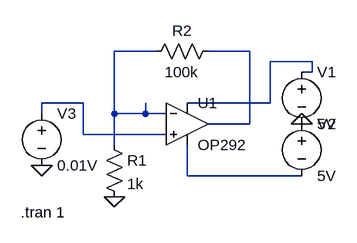
[diagram p0: schematic opamp.asc]
opamp.asc, the LTspice schematic file:
Version 4.1
SHEET 1 880 680
WIRE 144 16 80 16
WIRE 288 16 224 16
WIRE 384 32 320 32
WIRE 384 48 384 32
WIRE 384 48 368 48
WIRE 32 96 -32 96
WIRE 320 96 320 32
WIRE 320 96 192 96
WIRE -32 112 -32 96
WIRE 80 112 80 16
WIRE 128 112 128 96
WIRE 128 112 80 112
WIRE 160 112 128 112
WIRE 288 128 288 16
WIRE 288 128 224 128
WIRE 32 144 32 96
WIRE 160 144 32 144
WIRE 80 160 80 112
WIRE 192 208 192 160
WIRE 368 208 192 208
FLAG 368 128 0
FLAG 80 240 0
FLAG -32 192 0
SYMBOL OpAmps\\OP292 192 64 R0
SYMATTR InstName U1
SYMBOL res 64 144 R0
SYMATTR InstName R1
SYMATTR Value 1k
SYMBOL res 240 0 R90
WINDOW 0 0 56 VBottom 2
WINDOW 3 32 56 VTop 2
SYMATTR InstName R2
SYMATTR Value 100k
SYMBOL voltage 368 32 R0
WINDOW 123 0 0 Left 0
WINDOW 39 0 0 Left 0
SYMATTR InstName V1
SYMATTR Value 5V
SYMBOL voltage 368 112 R0
WINDOW 123 0 0 Left 0
WINDOW 39 0 0 Left 0
SYMATTR InstName V2
SYMATTR Value 5V
SYMBOL voltage -32 96 R0
WINDOW 123 0 0 Left 0
WINDOW 39 0 0 Left 0
SYMATTR InstName V3
SYMATTR Value 0.01V
TEXT -64 264 Left 2 !.tran 1

The netlist it stands for:
* opamp.asc
X§U1 N004 N001 N003 N005 N002 OP292  ; pins In+ In- V+ V- OUT
R1 N001 0 1k
R2 N002 N001 100k
V1 N003 0 5V
V2 0 N005 5V
V3 N004 0 0.01V
.tran 1
.lib ADI1.lib
.backanno
.end